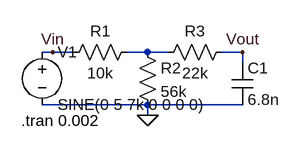
[diagram p0: schematic Draft1.asc]
Draft1.asc, the LTspice schematic file:
Version 4
SHEET 1 880 680
WIRE -16 160 -32 160
WIRE 16 160 -16 160
WIRE 128 160 96 160
WIRE 160 160 128 160
WIRE 272 160 240 160
WIRE 272 176 272 160
WIRE 128 240 -32 240
WIRE 272 240 128 240
WIRE 128 256 128 240
FLAG 128 256 0
FLAG -16 160 Vin
FLAG 272 160 Vout
SYMBOL cap 256 176 R0
SYMATTR InstName C1
SYMATTR Value 6.8n
SYMBOL res 112 144 R0
SYMATTR InstName R2
SYMATTR Value 56k
SYMBOL res 256 144 R90
WINDOW 0 0 56 VBottom 2
WINDOW 3 32 56 VTop 2
SYMATTR InstName R3
SYMATTR Value 22k
SYMBOL res 112 144 R90
WINDOW 0 0 56 VBottom 2
WINDOW 3 32 56 VTop 2
SYMATTR InstName R1
SYMATTR Value 10k
SYMBOL voltage -32 144 R0
WINDOW 123 0 0 Left 0
WINDOW 39 0 0 Left 0
SYMATTR InstName V1
SYMATTR Value SINE(0 5 7k 0 0 0 0)
TEXT -64 264 Left 2 !.tran 0.002

The netlist it stands for:
* Draft1.asc
C1 Vout 0 6.8n
R2 N001 0 56k
R3 Vout N001 22k
R1 N001 Vin 10k
V1 Vin 0 SINE(0 5 7k 0 0 0 0)
.tran 0.002
.backanno
.end